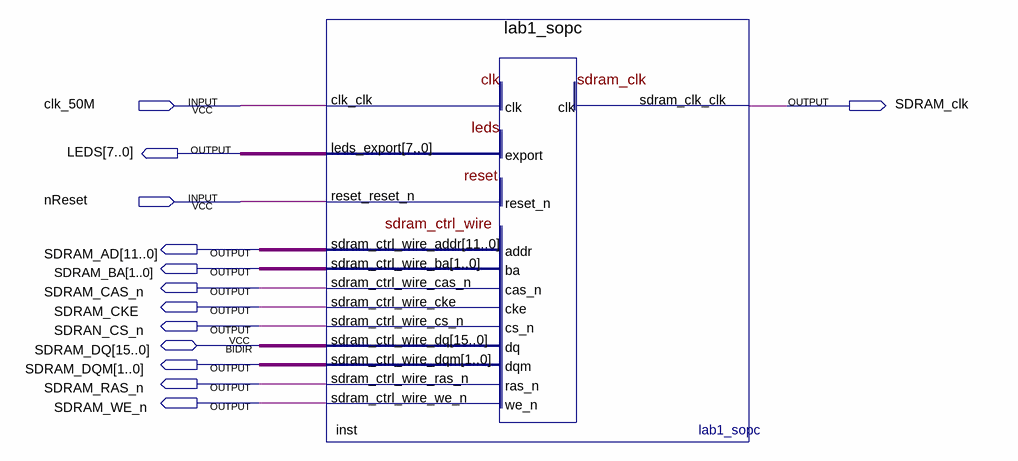
[diagram p0: schematic sheet]
// Quartus schematic lab1GetStarted.bdf as structural Verilog: 1 symbols, 13 pins
module lab1GetStarted (
  input  clk_50M,
  input  nReset,
  inout  [15:0] SDRAM_DQ,
  output SDRAM_clk,
  output [7:0] LEDS,
  output [11:0] SDRAM_AD,
  output [1:0] SDRAM_BA,
  output SDRAM_CAS_n,
  output SDRAM_CKE,
  output SDRAN_CS_n,
  output [1:0] SDRAM_DQM,
  output SDRAM_RAS_n,
  output SDRAM_WE_n
);

  lab1_sopc inst (
    .clk_clk(clk_50M), .reset_reset_n(nReset), .leds_export(LEDS), .sdram_clk_clk(SDRAM_clk),
    .sdram_ctrl_wire_addr(SDRAM_AD), .sdram_ctrl_wire_ba(SDRAM_BA), .sdram_ctrl_wire_cas_n(SDRAM_CAS_n),
    .sdram_ctrl_wire_cke(SDRAM_CKE), .sdram_ctrl_wire_cs_n(SDRAN_CS_n), .sdram_ctrl_wire_dqm(SDRAM_DQM),
    .sdram_ctrl_wire_ras_n(SDRAM_RAS_n), .sdram_ctrl_wire_we_n(SDRAM_WE_n), .sdram_ctrl_wire_dq(SDRAM_DQ));
endmodule
